# EAGLE design esp32_ssd1306 (EAGLE 7.1.0)
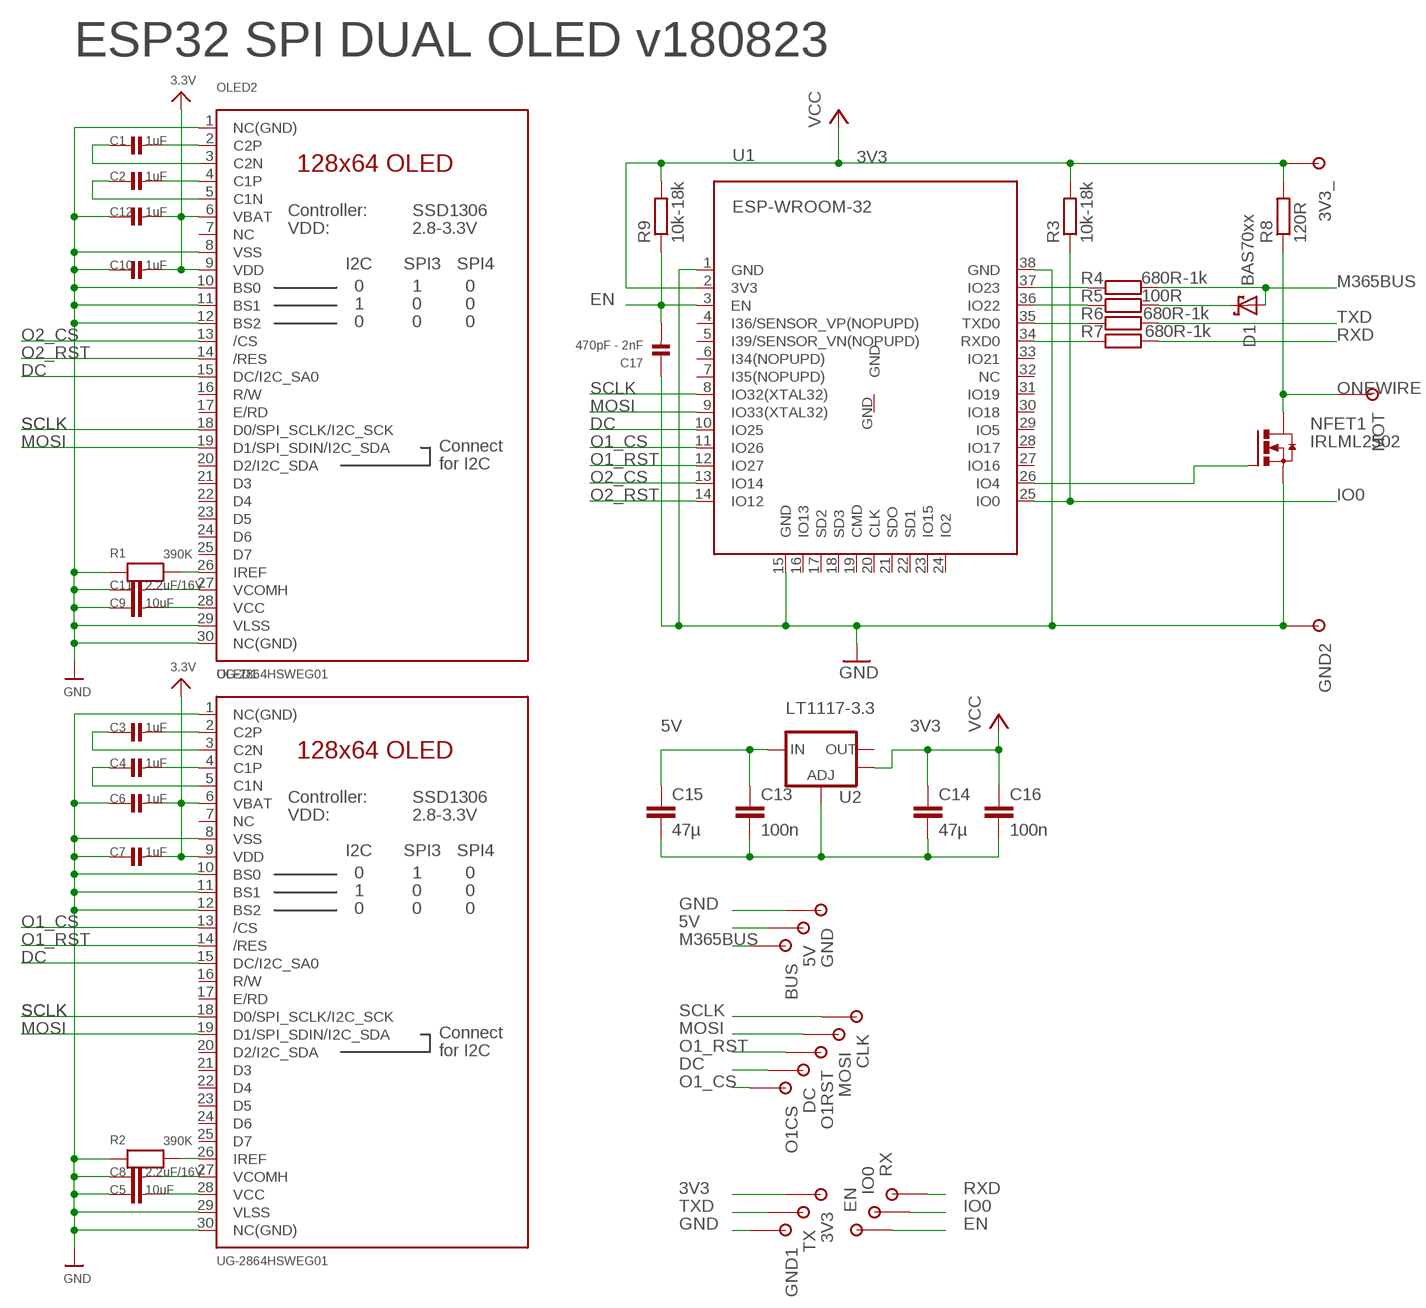
[diagram p0: schematic, sheet 1]

## Parts
3V3  PAD1  [PAD1]
3V3_  PAD1  [PAD1]
5V  PAD1  [PAD1]
BUS  PAD1  [PAD1]
C1  1uF  CAP_CERAMIC0805  [0805]
C2  1uF  CAP_CERAMIC0805  [0805]
C3  1uF  CAP_CERAMIC0805  [0805]
C4  1uF  CAP_CERAMIC0805  [0805]
C5  10uF  CAP_CERAMIC0805  [0805]
C6  1uF  CAP_CERAMIC0805  [0805]
C7  1uF  CAP_CERAMIC0805  [0805]
C8  2.2uF/16V  CAP_CERAMIC0805  [0805]
C9  10uF  CAP_CERAMIC0805  [0805]
C10  1uF  CAP_CERAMIC0805  [0805]
C11  2.2uF/16V  CAP_CERAMIC0805  [0805]
C12  1uF  CAP_CERAMIC0805  [0805]
C13  100n  C-EUC0805K  [C0805K]
C14  47µ  C-EUC1210K  [C1210K]
C15  47µ  C-EUC1210K  [C1210K]
C16  100n  C-EUC0805K  [C0805K]
C17  470pF - 2nF  CAP_CERAMIC0805  [0805]
CLK  PAD1  [PAD1]
D1  BAS70xx  BAS70  [SOT23]
DC  PAD1  [PAD1]
EN  PAD1  [PAD1]
GND  PAD1  [PAD1]
GND1  PAD1  [PAD1]
GND2  PAD1  [PAD1]
IO0  PAD1  [PAD1]
MOSI  PAD1  [PAD1]
MOT  PAD1  [PAD1]
NFET1  IRLML2502  [MICRO3]
O1CS  PAD1  [PAD1]
O1RST  PAD1  [PAD1]
OLED1  UG-2864HSWEG01  DISP_OLED_UG-2864HSWEG010.96"  [UG-2864HSWEG01_0.96IN_WRAPAROUND]
OLED2  UG-2864HSWEG01  DISP_OLED_UG-2864HSWEG010.96"  [UG-2864HSWEG01_0.96IN_WRAPAROUND]
R1  390K  RESISTOR0805  [0805]
R2  390K  RESISTOR0805  [0805]
R3  10k-18k  R-EU_R0805  [R0805]
R4  680R-1k  R-EU_R0805  [R0805]
R5  100R  R-EU_R0805  [R0805]
R6  680R-1k  R-EU_R0805  [R0805]
R7  680R-1k  R-EU_R0805  [R0805]
R8  120R  R-EU_R0805  [R0805]
R9  10k-18k  R-EU_R0805  [R0805]
RX  PAD1  [PAD1]
TX  PAD1  [PAD1]
U1  ESP-WROOM-32  [ESP-WROOM-32]
U2  LT1117-3.3  V_REG_LM1117SOT223  [SOT223]

## Nets
3V3: 3V3.P$1(PIN1) 3V3_.P$1(PIN1) C6.2 C7.2 C10.2 C12.2 C14.1 C16.1 OLED1.6(VBAT) OLED1.9(VDD) OLED2.6(VBAT) OLED2.9(VDD) R3.2 R8.2 R9.2 U1.2(3V3) U2.4(OUT) ; supply symbol labelled VCC, 3.3V
5V: 5V.P$1(PIN1) C13.1 C15.1 U2.3(IN)
DC: DC.P$1(PIN1) OLED1.15(DC/I2C_SA0) OLED2.15(DC/I2C_SA0) U1.10(IO25)
EN: C17.2 EN.P$1(PIN1) R9.1 U1.3(EN)
GND: C5.1 C6.1 C7.1 C8.1 C9.1 C10.1 C11.1 C12.1 C13.2 C14.2 C15.2 C16.2 C17.1 GND1.P$1(PIN1) GND2.P$1(PIN1) GND.P$1(PIN1) NFET1.2(S) OLED1.1(NC(GND)) OLED1.8(VSS) OLED1.10(BS0) OLED1.11(BS1) OLED1.12(BS2) OLED1.29(VLSS) OLED1.30(NC(GND)) OLED2.1(NC(GND)) OLED2.8(VSS) OLED2.10(BS0) OLED2.11(BS1) OLED2.12(BS2) OLED2.29(VLSS) OLED2.30(NC(GND)) R1.1 R2.1 U1.1(GND) U1.15(GND) U1.38(GND) U2.1(ADJ)
IO0: IO0.P$1(PIN1) R3.1 U1.25(IO0)
M365BUS: BUS.P$1(PIN1) D1.1(A) R4.2
MOSI: MOSI.P$1(PIN1) OLED1.19(D1/SPI_SDIN/I2C_SDA) OLED2.19(D1/SPI_SDIN/I2C_SDA) U1.9(IO33(XTAL32))
N$1: OLED2.26(IREF) R1.2
N$2: C1.2 OLED2.2(C2P)
N$3: OLED1.26(IREF) R2.2
N$4: C3.2 OLED1.2(C2P)
N$5: C3.1 OLED1.3(C2N)
N$6: C4.2 OLED1.4(C1P)
N$7: C4.1 OLED1.5(C1N)
N$8: C1.1 OLED2.3(C2N)
N$9: C2.2 OLED2.4(C1P)
N$10: C2.1 OLED2.5(C1N)
N$11: C5.2 OLED1.28(VCC)
N$12: C8.2 OLED1.27(VCOMH)
N$13: C9.2 OLED2.28(VCC)
N$14: C11.2 OLED2.27(VCOMH)
N$15: D1.3(C) R5.2
N$16: NFET1.1(G) U1.26(IO4)
N$17: R4.1 U1.37(IO23)
N$18: R5.1 U1.36(IO22)
N$21: R6.1 U1.35(TXD0)
N$22: R7.1 U1.34(RXD0)
O1_CS: O1CS.P$1(PIN1) OLED1.13(/CS) U1.11(IO26)
O1_RST: O1RST.P$1(PIN1) OLED1.14(/RES) U1.12(IO27)
O2_CS: OLED2.13(/CS) U1.13(IO14)
O2_RST: OLED2.14(/RES) U1.14(IO12)
ONEWIRE: MOT.P$1(PIN1) NFET1.3(D) R8.1
RXD: R7.2 RX.P$1(PIN1)
SCLK: CLK.P$1(PIN1) OLED1.18(D0/SPI_SCLK/I2C_SCK) OLED2.18(D0/SPI_SCLK/I2C_SCK) U1.8(IO32(XTAL32))
TXD: R6.2 TX.P$1(PIN1)
Unconnected: OLED1.7(NC) OLED1.16(R/W) OLED1.17(E/RD) OLED1.20(D2/I2C_SDA) OLED1.21(D3) OLED1.22(D4) OLED1.23(D5) OLED1.24(D6) OLED1.25(D7) OLED2.7(NC) OLED2.16(R/W) OLED2.17(E/RD) OLED2.20(D2/I2C_SDA) OLED2.21(D3) OLED2.22(D4) OLED2.23(D5) OLED2.24(D6) OLED2.25(D7) U1.4(I36/SENSOR_VP(NOPUPD)) U1.5(I39/SENSOR_VN(NOPUPD)) U1.6(I34(NOPUPD)) U1.7(I35(NOPUPD)) U1.16(IO13) U1.17(SD2) U1.18(SD3) U1.19(CMD) U1.20(CLK) U1.21(SDO) U1.22(SD1) U1.23(IO15) U1.24(IO2) U1.27(IO16) U1.28(IO17) U1.29(IO5) U1.30(IO18) U1.31(IO19) U1.32(NC) U1.33(IO21) U1.GND U2.2(OUT)

## Notes on the sheet
- ESP32 SPI DUAL OLED v180823

## Library data of the parts
3V3 3V3_ 5V BUS CLK DC EN GND GND1 GND2 IO0 MOSI MOT O1CS O1RST RX TX = Rainer:PAD1
C1-C12 C17 = microbuilder:CAP_CERAMIC: Ceramic Capacitors 0402 - 0402 Surface Mount Capacitors 16pF 50V 5% [Digikey: 445-4899-2-ND] 18pF 50V 5% [Digikey: 490-1281-2-ND] 22pF 50V 5% [Digikey: 490-1283-2-ND] 68pF 50V 5% [Digikey: 490-1289-2-ND] 0.1uF 10V 10% [Digikey: 490-1318-2-ND] 1.0uF 6.3V 10% [Digikey: 490-1320-2-ND] 0603 - 0603 Surface Mount Capacitors 16 pF 50V 5% [Digikey: 445-5051-2-ND] 22 pF 50V [Digikey: PCC220ACVTR-ND] 33 pF 50V 5% [Digikey: 490-1415-1-ND] 56pF 50V 5% [Digikey: 490-1421-1-ND] 220pF 50V 5% [Digikey: 445-1285-1-ND] 680 pF 50V 2200 pF 50V 5% C0G [Digikey: 445-1297-1-ND] 5600 pF 100V 5% X7R [Digikey: 478-3711-1-ND] 0.1 µF 25V 10% [Digikey: PCC2277TR-ND] 0.22 µF 16V 10% X7R [Digikey: 445-1318-1-ND] 1.0 µF 25V 10% [Digikey: 445-5146-2-ND] 0603 - RF Specific 3pF 250V +/-0.1pF RF [Digikey: 712-1347-1-ND] 18 pF 250V 5% [Digikey: 478-3505-1-ND or 712-1322-1-ND] 56 pF 250V 5% C0G RF [Digikey: 490-4867-1-ND] 68 pF 250V RF [Digikey: 490-4868-1-ND] 0805 - 0805 Surface Mount Capacitors 220 pF 250V 2% RF Ceramic Capacitor [Digikey: 712-1398-1-ND] 1000 pF 50V 2% NP0 Ceramic Capacitor [Digikey: 478-3760-1-ND] 0.1 µF 25V 10% Ceramic Capacitor [Digikey: PCC1828TR-ND] 1.0 µF 16V 10% Ceramic Capacitor[Digikey: 490-1691-2-ND] 10.0 µF 10V 10% Ceramic Capacitor[Digikey: 709-1228-1-ND] 10.0 uF 16V 10% Ceramic Capacitor [Digikey: 478-5165-2-ND] 47 uF 6.3V 20% Ceramic Capacitor [Digikey: 587-1779-1-ND or 399-5506-1-ND] 1206 - 1206 Surface Mount Capacitors 47uF 10V 20% Ceramic Capacitor [Digikey: 490-5528-1-ND or 399-5508-1-ND or 445-6010-1-ND] 100uF 6.3V -20%, +80% Y5V Ceramic Capacitor (Digikey: 490-4512-1-ND, Mouser: 81-GRM31CF50J107ZE1L)
C13-C16 = rcl:C-EU: CAPACITOR, European symbol
D1 = diode:BAS70: Silicon Schottky Diodes General-purpose diode for high-speed switching
NFET1 = transistor-power:IRLML2502
OLED1 OLED2 = ssd1306:DISP_OLED_UG-2864HSWEG01: UG-2864HSWEG01 OLED display Both 1.3" and 0.96" models share the same FPC tab footprint, only the screen dimensions vary.
R1 R2 = microbuilder:RESISTOR: Resistors 0402 - 0402 Surface Mount Package 22 Ohm 1% 1/16W [Digikey: 311-22.0LRTR-ND] 33 Ohm 5% 1/16W 1.0K 5% 1/16W 1.5K 5% 1/16W 2.0K 1% 1/16W 10.0K 1% 1/16W [Digikey: 311-10.0KLRTR-ND] 10.0K 5% 1/16W [Digikey: RMCF0402JT10K0TR-ND] 12.1K 1% 1/16W [Digikey: 311-22.0LRTR-ND] 100.0K 5% 1/16W 0603 - 0603 Surface Mount Package 0 Ohm 1/10 Watt 1% Resistor 15 Ohm 1/10 Watt 1% Resistor 33 Ohm 1/10 Watt 1% Resistor 49.9 Ohm 1/10 Watt 1% Resistor 100 Ohm 1/10 Watt 1% Resistor 150 Ohm 1/10 Watt 1% Resistor 240 Ohm 1/10 Watt 1% Resistor 390 Ohm 1/10 Watt 1% Resistor 560 Ohm 1/10 Watt 1% Resistor 680 Ohm 1/10 Watt 1% Resistor 750 Ohm 1/10 Watt 1% Resistor 1.0K Ohm 1/10 Watt 1% Resistor 1.5K Ohm 1/10 Watt 1% Resistor 2.0K Ohm 1/10 Watt 1% Resistor 2.2K Ohm 1/10 Watt 1% Resistor 3.3K Ohm 1/10 Watt 1% Resistor 4.7K Ohm 1/10 Watt 1% Resistor 10.0K Ohm 1/10 Watt 1% Resistor 12.0K Ohm 1/10 Watt 1% Resistor 12.1K Ohm 1/10 Watt 1% Resistor 20.0K Ohm 1/10 Watt 1% Resistor 33.0K Ohm 1/10 Watt 1% Resistor 100.0K Ohm 1/10 Watt 1% Resistor 0805 - 0805 Surface Mount Package 0 Ohm 1/8 Watt 1% Resistor 33 Ohm 1/8 Watt 1% Resistor 100 Ohm 1/8 Watt 1% Resistor 150 Ohm 1/8 Watt 1% Resistor 200 Ohm 1/8 Watt 1% Resistor 240 Ohm 1/8 Watt 1% Resistor 330 Ohm 1/8 Watt 1% Resistor 390 Ohm 1/8 Watt 1% Resistor 470 Ohm 1/8 Watt 1% Resistor 1.0K Ohm 1/8 Watt 1% Resistor 1.5K Ohm 1/8 Watt 1% Resistor 2.0K Ohm 1/8 Watt 1% Resistor 4.7K Ohm 1/8 Watt 1% Resistor 5.1K Ohm 1/8 Watt 1% Resistor 5.6K Ohm 1/8 Watt 1% Resistor 10.0K Ohm 1/8 Watt 1% Resistor 22.0K Ohm 1/8 Watt 1% Resistor 33.0K Ohm 1/8 Watt 1% Resistor 100K Ohm 1/8 Watt 1% Resistor 1206 - 1206 Surface Mount Package 2012 - 2010 Surface Mount Package 0.11 Ohm 1/2 Watt 1% Resistor - Digikey: RHM.11UCT-ND
R3-R9 = rcl:R-EU_: RESISTOR, European symbol
U1 = esp32:ESP-WROOM-32
U2 = SparkFunEagle-6-6-07:V_REG_LM1117: Voltage Regulator LM1117 Standard adjustable voltage regulator but in SMD form. Spark Fun Electronics SKU : COM-00595

## Board
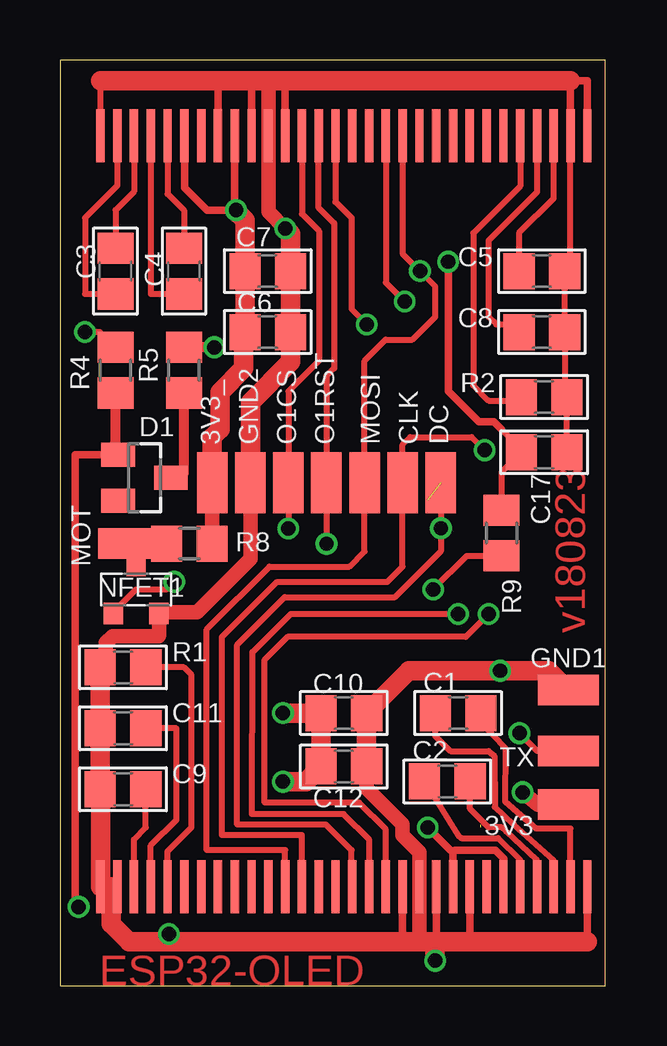
[diagram p1: board, top side]
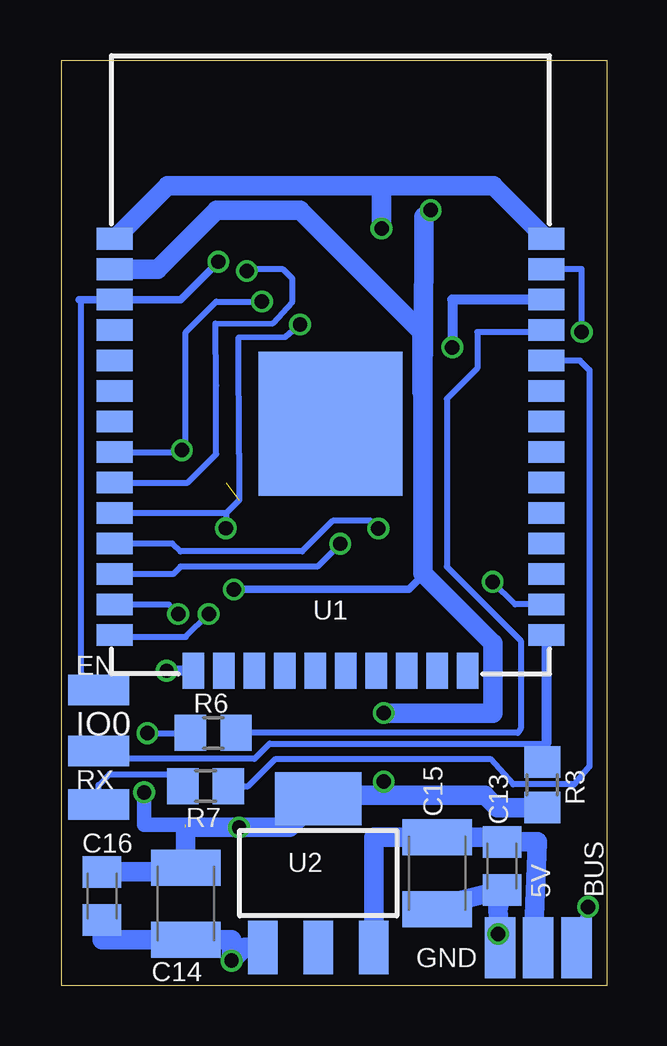
[diagram p2: board, bottom side, seen from below]

Size 22.73 x 38.57 mm. Coordinates in mm from the lower left corner, seen from the top.
Outline: 0,0 22.73,0 22.73,38.57 0,38.57 0,0
Copper layers (1*16): Top 0.035mm / dielectric 1.5mm / Bottom 0.035mm
Design rules "ITEADstudio_DRC": minimum track width 6mil, minimum drill 12mil, track to track 6mil, track to pad 6mil, pad to pad 6mil, via to via 6mil, smd to smd 0mil, copper to edge 10mil, drill to drill 10mil, minimum pad ring 10mil, minimum via ring 6mil, stop-mask expansion 2mil, vias tented up to drill 100mil, thermal gap 10mil

### Footprints (pad centres in the part's own frame; a part is rotated, then mirrored left to right if it is on the bottom)
PAD1 = smd 2.54 x 1.27: P$1 0,0
0805 = smd 1.3 x 1.5: 1 -0.95,0; 2 0.95,0
C0805K = smd 1.3 x 1.6: 1 -1,0; 2 1,0
C1210K = smd 1.5 x 2.9: 1 -1.5,0; 2 1.5,0
SOT23 = smd 1 x 1.4: 1 -0.95,-1.1; 2 0.95,-1.1; 3 0,1.1
MICRO3 = smd 0.8 x 0.9: 1 -0.95,-1; 2 0.95,-1; 3 0,1
UG-2864HSWEG01_0.96IN_WRAPAROUND = smd 0.35 x 2.2 bottom: 1 -10.15,-1.2; 2 -9.45,-1.2; 3 -8.75,-1.2; 4 -8.05,-1.2; 5 -7.35,-1.2; 6 -6.65,-1.2; 7 -5.95,-1.2; 8 -5.25,-1.2; 9 -4.55,-1.2; 10 -3.85,-1.2; 11 -3.15,-1.2; 12 -2.45,-1.2; 13 -1.75,-1.2; 14 -1.05,-1.2; 15 -0.35,-1.2; 16 0.35,-1.2; 17 1.05,-1.2; 18 1.75,-1.2; 19 2.45,-1.2; 20 3.15,-1.2; 21 3.85,-1.2; 22 4.55,-1.2; 23 5.25,-1.2; 24 5.95,-1.2; 25 6.65,-1.2; 26 7.35,-1.2; 27 8.05,-1.2; 28 8.75,-1.2; 29 9.45,-1.2; 30 10.15,-1.2
R0805 = smd 1.3 x 1.5: 1 -0.95,0; 2 0.95,0
ESP-WROOM-32 = smd 0.9 x 1.5: 1 7.7,9; 2 6.43,9; 3 5.16,9; 4 3.89,9; 5 2.62,9; 6 1.35,9; 7 0.08,9; 8 -1.19,9; 9 -2.46,9; 10 -3.73,9; 11 -5,9; 12 -6.27,9; 13 -7.54,9; 14 -8.81,9; 25 -8.81,-9; 26 -7.54,-9; 27 -6.27,-9; 28 -5,-9; 29 -3.73,-9; 30 -2.46,-9; 31 -1.19,-9; 32 0.08,-9; 33 1.35,-9; 34 2.62,-9; 35 3.89,-9; 36 5.16,-9; 37 6.43,-9; 38 7.7,-9 | smd 1.5 x 0.9: 15 -10.3,5.715; 16 -10.3,4.445; 17 -10.3,3.175; 18 -10.3,1.905; 19 -10.3,0.635; 20 -10.3,-0.635; 21 -10.3,-1.905; 22 -10.3,-3.175; 23 -10.3,-4.445; 24 -10.3,-5.715 | smd 6 x 6: GND 0,0
SOT223 = smd 1.219 x 2.235: 1 -2.311,-3.099; 2 0,-3.099; 3 2.311,-3.099 | smd 3.6 x 2.2: 4 0,3.099

### Placement (x,y rotation side)
3V3  21.19,7.55 0 top
3V3_  6.35,20.95 90 top
5V  2.86,1.59 270 bottom
BUS  1.27,1.59 270 bottom
C1  16.6,11.36 0 top
C2  16.15,8.51 0 top
C3  2.31,29.77 270 top
C4  5.17,29.77 270 top
C5  20.09,29.77 180 top
C6  8.66,27.23 180 top
C7  8.66,29.77 180 top
C8  20.09,27.23 180 top
C9  2.63,8.18 0 top
C10  11.84,11.36 180 top
C11  2.63,10.72 0 top
C12  11.84,9.14 180 top
C13  4.37,4.99 270 bottom
C14  17.55,3.42 270 bottom
C15  7.08,4.69 270 bottom
C16  21.05,3.74 270 bottom
C17  20.19,22.23 180 top
CLK  14.29,20.95 90 top
D1  3.53,21.17 270 top
DC  15.88,20.95 90 top
EN  21.19,12.31 0 bottom
GND  4.45,1.59 270 bottom
GND1  21.19,12.31 0 top
GND2  7.94,20.95 90 top
IO0  21.19,9.77 0 bottom
MOSI  12.7,20.95 90 top
MOT  2.86,18.41 0 top
NFET1  3.17,16.51 0 top
O1CS  9.53,20.95 90 top
O1RST  11.11,20.95 90 top
OLED1  11.84,34.22 180 bottom
OLED2  11.84,5.33 0 bottom
R1  2.63,13.26 0 top
R2  20.19,24.53 180 top
R3  2.7,8.37 270 bottom
R4  2.31,25.65 270 top
R5  5.17,25.65 270 top
R6  16.41,10.53 180 bottom
R7  16.73,8.31 180 bottom
R8  5.4,18.41 0 top
R9  18.41,18.86 270 top
RX  21.19,7.55 0 bottom
TX  21.19,9.77 0 top
U1  11.52,23.42 90 bottom
U2  12.03,4.69 0 bottom

### Tracks (layer width: path | path; a pad name or v marks a point on that pad's centre or on a via)
3V3  (via drill 0.6 pad 0.3, 0.6 pad 0.41)  (1 unrouted)
  Top 0.254: 7.29,29.77 C7.2 | 16.39,5.54 16.29,5.64 16.38,5.56 | 16.39,5.54 16.38,5.56 | 15.33,6.51 v15.33,6.6 | OLED2.6 18.51,4.13 | 16.46,5.64 arc90 16.38,5.56 | v15.56,16.51 16.96,17.91 R9.2
  Top 0.305: OLED2.9 16.39,5.54 | 16.29,5.64 v15.33,6.6 | 18.51,4.13 18.51,5.28 18.16,5.64 16.46,5.64 | OLED1.9 7.29,32.31 | OLED1.6 5.19,33.25 6.12,32.31 7.29,32.31 | 7.29,32.31 v7.34,32.31
  Top 0.61: v19.29,8.06 19.92,7.54 3V3.P$1 | 3V3_.P$1 R8.2
  Top 0.813: v9.3,11.36 C10.2 C12.2 10.26,8.5 v9.3,8.5 | 7.29,32.31 7.71,31.89 C7.2 C6.2 7.66,27.18 7.66,25.72 6.67,24.72 6.67,23.18 6.35,22.86 3V3_.P$1
  Bottom 0.254: 15.52,6.51 15.24,6.51 v15.33,6.6 | U1.2 20.52,29.77 | 7.39,24.69 7.66,24.69
  Bottom 0.305: v15.56,16.51 8.26,16.51 7.62,17.14
  Bottom 0.406: C14.1 17.55,4.74 17.78,4.74
  Bottom 0.61: 17.55,6.7 19.29,6.7 v19.29,8.06
  Bottom 0.813: v9.3,11.36 4.75,11.36 4.75,14.28 7.62,17.14 7.66,17.19 7.66,24.69 | 7.66,24.69 7.62,30.8 7.62,32.04 v7.34,32.31 | v9.3,8.5 9.3,7.94 | R3.2 4.57,7.42 5.08,7.94 9.3,7.94 | 9.3,7.94 11.88,7.94 U2.4 13.22,6.6 v15.33,6.6 17.55,6.6 C14.1 | C16.1 17.78,4.74 17.19,4.74 | U1.2 18.72,29.85 16.26,32.31 12.79,32.31 C6.2 7.71,24.75 7.66,24.69
5V
  Bottom 0.406: 5V.P$1 3.06,1.84
  Bottom 0.813: 3.06,1.84 2.9,5.99 C13.1 4.37,6.19 C15.1 9.72,6.19 U2.3
DC  (via drill 0.6 pad 0.41)  (1 unrouted)
  Top 0.254: OLED2.15 12.16,4.16 12.16,5.64 11.09,6.71 7.39,6.71 7.39,14.22 9.37,16.19 13.97,16.19 15.88,18.1 DC.P$1 | OLED1.15 11.49,32.66 12.16,32 12.16,28.19 v12.79,27.55
  Bottom 0.254: v12.79,27.55 13.4,27.04 15.35,27.01 15.33,22.15 15.33,20.23 15.88,19.68 | U1.10 16.52,19.69 16.51,19.68 15.88,19.68 | 15.88,19.68 15.88,19.07 v15.89,19.06
EN  (via drill 0.6 pad 0.41)
  Top 0.254: 18.41,23.18 19.37,22.23 C17.2 18.41,21.4 R9.1
  Top 0.305: v16.19,30.16 16.19,24.77 17.46,23.5 18.1,23.5 18.41,23.18
  Bottom 0.254: 21.91,28.58 U1.3 | EN.P$1 21.91,13.03 21.91,28.58 | 21.91,28.58 22,28.58
  Bottom 0.305: 22,28.58 17.77,28.58 v16.19,30.16
GND  (via drill 0.6 pad 0.3, 0.6 pad 0.41)
  Top 0.254: OLED1.1 1.69,37.71 | 22,37.71 OLED1.30 | OLED1.29 21.29,30.02 C5.1 C8.1 21.05,24.62 R2.1 | 15.69,1.83 15.65,1.83 | C7.1 | R2.1 21.27,24.4 | C17.1 R2.1
  Top 0.305: OLED1.29 21.29,37.71 21.99,37.71 OLED1.30 | OLED1.10 7.99,37.71 | OLED1.12 9.39,37.71 | OLED1.8 6.59,37.71 | 17.09,1.83 OLED2.8 | OLED2.12 14.29,1.83 | OLED2.10 15.69,1.83 | OLED2.11 14.99,2.09 14.99,1.83 | OLED2.1 21.99,1.83 | 18.33,13.12 v18.36,13.12 | OLED2.29 OLED2.30
  Top 0.61: C9.1 | C6.1 | 8.64,37.71 8.69,37.71 OLED1.11 8.69,32.25 v9.39,31.55 | R1.1 1.91,13.26 1.91,14.29 2.2,14.55 4.11,14.55 4.12,14.61 NFET1.2 4.17,15.56 5.71,15.56 7.94,17.78 GND2.P$1 | C12.1 12.79,8.22 14.28,6.73 14.28,6.26 14.99,5.55 14.99,2.09
  Top 0.813: 1.69,37.71 6.59,37.71 7.99,37.71 8.64,37.71 9.39,37.71 21.29,37.71 | 4.54,1.83 14.29,1.83 14.99,1.83 15.65,1.83 v15.64,1.04 | 15.69,1.83 17.09,1.83 21.99,1.83 | C12.1 C10.1 14.55,13.12 18.33,13.12 | C9.1 OLED2.30 2.14,4.13 2.14,2.58 2.88,1.83 4.54,1.83 | C9.1 C11.1 R1.1 | C6.1 9.62,25.99 7.94,24.31 GND2.P$1 | C6.1 C7.1 | C7.1 9.62,31.32 v9.39,31.55 | v18.36,13.12 20.39,13.12 GND1.P$1 | 4.54,1.83 v4.54,2.15
  Bottom 0.254: v4.54,2.15 GND.P$1 arc90 4.75,0.62
  Bottom 0.406: GND.P$1 4.38,0.57 | U1.15 v18.36,13.12 | v18.36,13.12
  Bottom 0.813: U2.1 15.09,1.59 v15.64,1.04 15.64,1.92 C14.2 21.05,1.92 C16.2 | C15.2 6.92,3.35 C13.2 4.54,3.19 GND.P$1 | U1.1 18.31,33.34 9.39,33.34 | 9.39,33.34 4.74,33.34 U1.38 | v9.39,31.55 9.39,33.34
IO0
  Bottom 0.254: R3.1 2.52,9.5 2.52,10.09 14.06,10.09 14.7,9.45 20.87,9.45 IO0.P$1 20.96,9.55
  Bottom 0.406: U1.25 2.52,10.09
M365BUS  (via drill 0.6 pad 0.3)
  Top 0.305: v0.78,3.29 0.64,3.42 0.64,22.11 D1.1
  Top 0.406: D1.1 arc-90 2.31,22.64 R4.2
  Bottom 0.305: BUS.P$1 1.21,2.31 v0.78,3.29
MOSI  (via drill 0.6 pad 0.41)
  Top 0.254: OLED2.19 9.39,5.64 6.12,5.64 6.12,14.85 8.74,17.46 12.06,17.46 12.7,18.1 MOSI.P$1 12.7,26.04 13.58,26.92 14.7,26.92 15.65,27.87 15.65,29.14 v15.02,29.77 14.29,30.5 OLED1.19
  Bottom 0.254: U1.9 17.48,20.96 16.29,22.15 16.29,25.01 16.32,27.58 13.91,27.61 13.11,28.5 13.11,29.46 13.5,29.84 14.92,29.84 v15.02,29.77
N$1
  Top 0.254: R1.2 5.17,13.26 5.49,12.95 5.49,6.6 4.49,5.6 OLED2.26
N$2
  Top 0.254: OLED2.2 21.28,6.54 19.87,6.54 18.55,7.68 18.57,9.89 17.55,10.95 C1.2
N$3
  Top 0.254: OLED1.26 19.19,33.31 17.24,31.36 17.24,25.01 17.87,24.38 19.07,24.38 R2.2
N$4
  Top 0.254: OLED1.2 2.39,33.34 1.04,32 1.04,28.82 C3.2
N$5
  Top 0.254: OLED1.3 3.09,33.09 2.31,32.31 C3.1
N$6
  Top 0.254: OLED1.4 3.79,28.82 C4.2
N$7
  Top 0.254: OLED1.5 4.49,33 5.17,32.31 C4.1
N$8
  Top 0.254: OLED2.3 20.59,5.22 18.93,6.71 18.13,7.45 18.11,9.57 17.87,9.77 16.29,9.77 15.65,10.4 C1.1
N$9
  Top 0.254: 17.55,8.5 C2.2 17.1,7.37 17.87,6.6 18.43,6.6 18.6,6.43 19.88,5.25 19.89,5.18 OLED2.4
N$10
  Top 0.254: OLED2.5 19.19,5.24 18.28,6.15 16.73,6.15 16.6,6.28 C2.1
N$11
  Top 0.254: 19.46,30.09 arc-90 C5.2 19.14,31.36 20.59,32.81 OLED1.28
N$12
  Top 0.254: OLED1.27 19.89,33.06 17.87,31.04 17.87,27.87 18.19,27.55 18.83,27.55 C8.2
N$13
  Top 0.254: OLED2.28 3.09,6.1 3.58,6.59 C9.2
N$14
  Top 0.254: C11.2 4.86,10.72 4.86,6.91 3.79,5.85 OLED2.27
N$15
  Top 0.406: D1.3 arc90 5.17,21.37 R5.2
N$16  (via drill 0.6 pad 0.3)
  Top 0.254: NFET1.1 2.23,15.56 3.17,16.51 4.45,16.51 v4.76,16.83
  Bottom 0.254: U1.26 3.82,15.88 v4.76,16.83
N$17  (via drill 0.6 pad 0.3)
  Top 0.254: R4.1 1.68,27.23 v1.04,27.23
  Top 0.406: R4.1 arc-90 2,26.28
  Bottom 0.254: v1.04,27.23 1.04,29.85 U1.37
N$18  (via drill 0.6 pad 0.3)
  Top 0.406: v6.44,26.6 R5.1
  Bottom 0.406: U1.36 6.44,28.58 v6.44,26.6
N$21
  Bottom 0.254: U1.35 2.6,27.23 5.4,27.23 5.4,25.72 6.67,24.45 6.67,17.46 3.58,14.38 3.58,10.72 3.71,10.53 R6.1
N$22
  Bottom 0.254: U1.34 1.12,26.04 0.73,25.65 0.73,9.14 1.36,8.38 3.9,8.38 4.86,9.45 13.81,9.45 14.95,8.31 R7.1
O1_CS  (via drill 0.6 pad 0.3)
  Top 0.254: OLED1.13 10.09,32.16 10.79,31.45 10.79,26.04 9.53,24.77 O1CS.P$1 v9.53,19.05
  Bottom 0.254: v9.53,19.05 9.84,19.37 11.43,19.37 12.7,18.1 17.78,18.1 18.11,18.42 U1.11
O1_RST  (via drill 0.6 pad 0.3)
  Top 0.254: OLED1.14 10.79,32.41 11.43,31.77 11.43,25.72 11.11,25.4 O1RST.P$1 v11.11,18.41
  Bottom 0.254: 20.44,17.07 U1.12 18.09,17.15 17.78,17.46 12.06,17.46 v11.11,18.41
O2_CS  (via drill 0.6 pad 0.3)
  Top 0.254: OLED2.13 13.59,6.51 12.47,7.63 8.53,7.63 8.53,13.58 9.49,14.53 16.92,14.53 v17.87,15.49
  Bottom 0.254: U1.13 18.27,15.88 v17.87,15.49
O2_RST  (via drill 0.6 pad 0.3)
  Top 0.254: OLED2.14 12.9,6.07 11.82,7.15 8.01,7.15 8.03,13.9 9.62,15.49 v16.6,15.49
  Bottom 0.254: U1.14 20.44,14.53 17.55,14.53 v16.6,15.49
ONEWIRE
  Top 0.61: NFET1.3 3.17,18.41 MOT.P$1 R8.1
RXD
  Bottom 0.254: 17.84,8.53 17.55,8.18 R7.2 arc-90 18.18,8.81 20.74,8.81 21.19,8.36 RX.P$1
SCLK  (via drill 0.6 pad 0.41)
  Top 0.254: OLED2.18 10.09,6.28 6.76,6.28 6.76,14.53 9.05,16.83 13.65,16.83 14.29,17.46 CLK.P$1 14.29,22.54 14.61,22.86 17.16,22.86 v17.71,22.31 | OLED1.18 13.59,29.29 v14.38,28.5
  Bottom 0.254: U1.8 17.79,22.23 v17.71,22.31 17.55,22.47 17.55,27.23 16.29,28.5 v14.38,28.5
TXD  (via drill 0.6 pad 0.41)
  Top 0.254: TX.P$1 19.91,9.77 v19.16,10.52
  Bottom 0.254: v19.16,10.52 17.37,10.52
  Bottom 0.305: 17.37,10.52 R6.2

### Text on the board
Top: v180823 | ESP32-OLED